# EAGLE schematic 7seg_keypad (EAGLE 8.2.0)
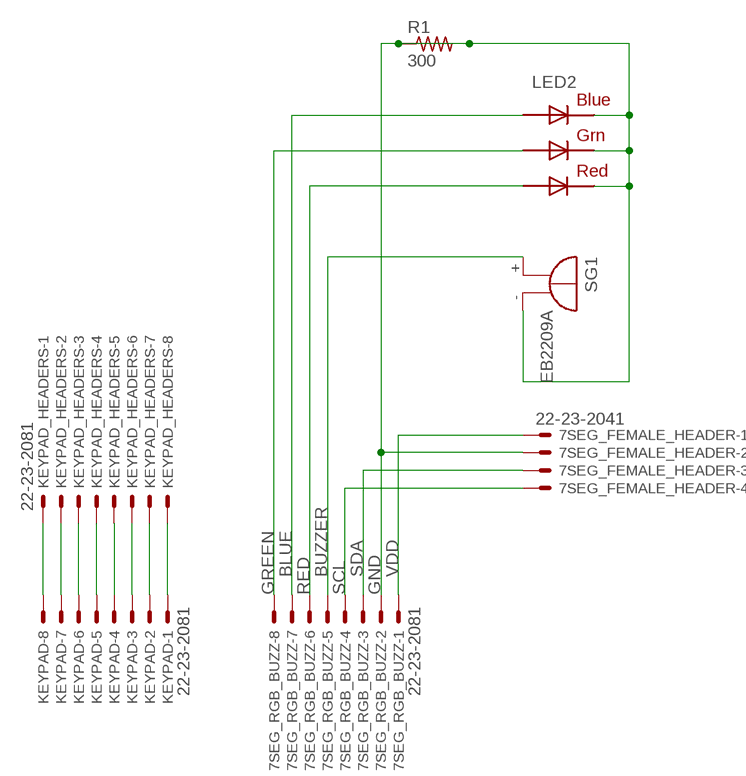
[diagram p0: schematic, sheet 1]

## Parts
7SEG_FEMALE_HEADER  22-23-2041  [22-23-2041]
7SEG_RGB_BUZZ  22-23-2081  [22-23-2081]
KEYPAD  22-23-2081  [22-23-2081]
KEYPAD_HEADERS  22-23-2081  [22-23-2081]
LED2  RGBLED5050  [RGBLED5050]
R1  300  R-US_0204/2V  [0204V]
SG1  EB2209A  [EB2209A]

## Nets
BLUE: 7SEG_RGB_BUZZ.7 LED2.3(BLUE_A)
BUZZER: 7SEG_RGB_BUZZ.5 SG1.+
GND: 7SEG_FEMALE_HEADER.2 7SEG_RGB_BUZZ.2 LED2.4(BLUE_C) LED2.5(RED_C) LED2.6(GREEN_C) R1.1 R1.2 SG1.-
GREEN: 7SEG_RGB_BUZZ.8 LED2.1(GREEN_A)
N$1: KEYPAD.8 KEYPAD_HEADERS.1
N$2: KEYPAD.7 KEYPAD_HEADERS.2
N$3: KEYPAD.6 KEYPAD_HEADERS.3
N$4: KEYPAD.5 KEYPAD_HEADERS.4
N$5: KEYPAD.4 KEYPAD_HEADERS.5
N$6: KEYPAD.3 KEYPAD_HEADERS.6
N$7: KEYPAD.2 KEYPAD_HEADERS.7
N$8: KEYPAD.1 KEYPAD_HEADERS.8
RED: 7SEG_RGB_BUZZ.6 LED2.2(RED_A)
SCL: 7SEG_FEMALE_HEADER.4 7SEG_RGB_BUZZ.4
SDA: 7SEG_FEMALE_HEADER.3 7SEG_RGB_BUZZ.3
VDD: 7SEG_FEMALE_HEADER.1 7SEG_RGB_BUZZ.1

## Library data of the parts
7SEG_FEMALE_HEADER = con-molex:22-23-2041: .100" (2.54mm) Center Header - 4 Pin; MF: MOLEX; MPN: 22-23-2041; OC_FARNELL: 1462920; OC_NEWARK: 38C0355
7SEG_RGB_BUZZ KEYPAD KEYPAD_HEADERS = con-molex:22-23-2081: .100" (2.54mm) Center Header - 8 Pin; MF: MOLEX; MPN: 22-23-2081; OC_FARNELL: 1756826; OC_NEWARK: 01C7592
LED2 = adafruit:RGBLED: For 5050 RGB LEDs, the order of the LEDs may vary from one manufacturer to another!
R1 = adafruit:R-US_: RESISTOR, American symbol
SG1 = buzzer:EB2209A: BUZZER Source: Buerklin; OC_FARNELL: unknown; OC_NEWARK: unknown